# Altium schematic sheet USB-C.SchDoc
size A4; SheetNumber: 3; SheetTotal: 8
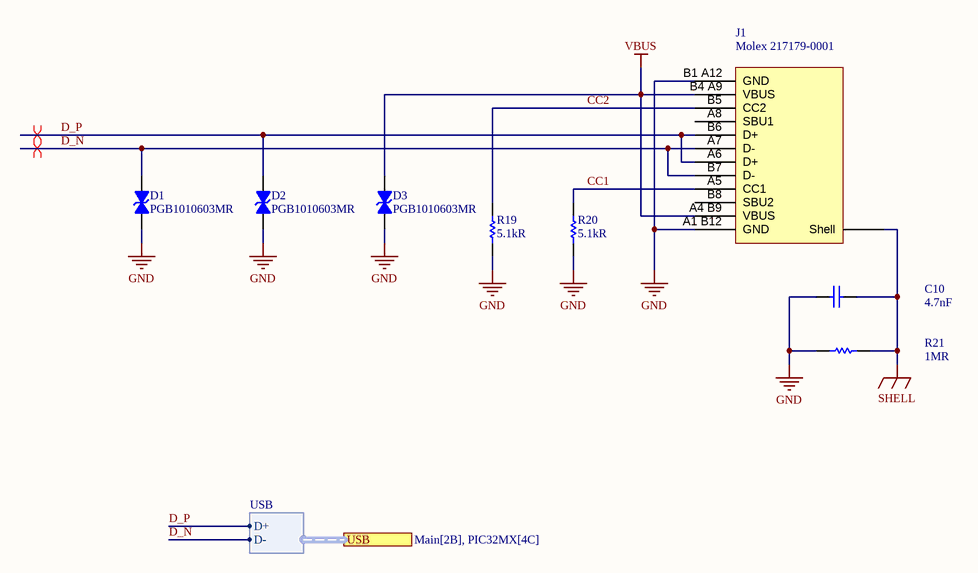
[diagram p0: USB-C.SchDoc]

## Parts
C10  4.7nF  [Capacitor 0603]
D1  PGB1010603MR  [Diode TVS 0603]
D2  PGB1010603MR  [Diode TVS 0603]
D3  PGB1010603MR  [Diode TVS 0603]
J1  Molex 217179-0001  [Molex 217179-0001]
R19  5.1kR  [Resistor 0603]
R20  5.1kR  [Resistor 0603]
R21  1MR  [Resistor 0603]

## Ports
USB (harness USB, see Main[2B], PIC32MX[4C])

## Harnesses
USB: D+, D-

## Nets
GND: C10.1 D1.2 D2.2 D3.2 J1.A1_B12(GND) J1.B1_A12(GND) R19.1 R20.1 R21.2
SHELL: C10.2 J1.Shell R21.1
VBUS: D3.1 J1.A4_B9(VBUS) J1.B4_A9(VBUS)
CC1: J1.A5(CC1) R20.2
CC2: J1.B5(CC2) R19.2
D_N: D1.1 J1.A7(D-) J1.B7(D-) ; port USB.D-
D_P: D2.1 J1.A6(D+) J1.B6(D+) ; port USB.D+

Not connected (* = marked no-connect by the designer): J1 A8(SBU1) B8(SBU2)

## Layout directives
differential pair: D_N, D_P

## Notes on the sheet
- TITLE
- SIZE
- A4
- VARIANT
- PROJECT
- SHEET
- VERSION
- OF
- AUTHOR
- DATE

## Library data of the parts
C10 = Capacitor
D1-D3 = Diode TVS
J1 = USB-C Receptacle (16 Pin)
R19-R21 = Resistor